# EAGLE schematic micro_2 (EAGLE 9.6.2)
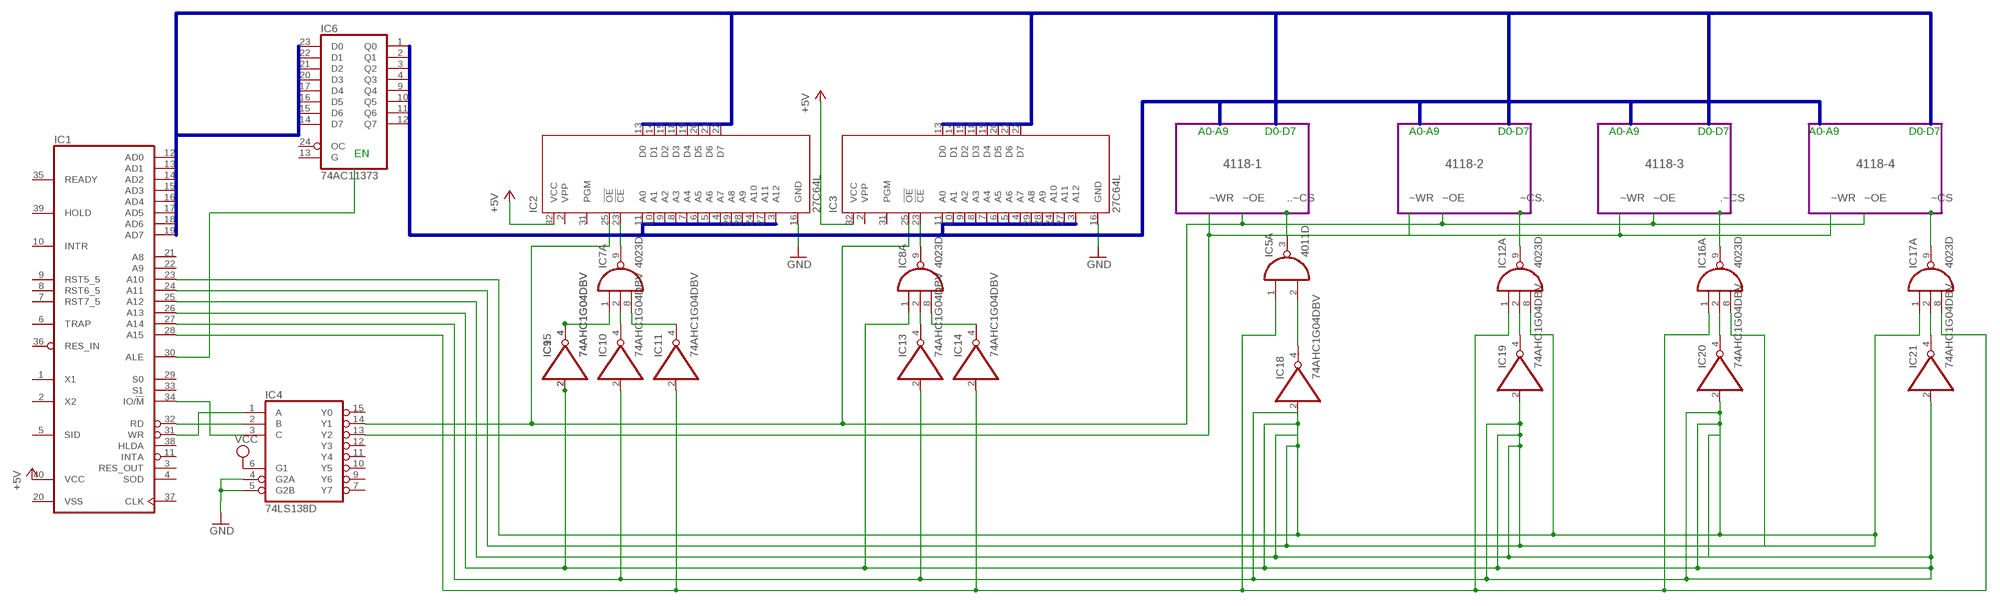
[diagram p0: schematic, sheet 1]

## Parts
IC1  8085  [DIL40]
IC2  27C64L  [PLCC-32]
IC3  27C64L  [PLCC-32]
IC4  74LS138D  [SO16]
IC5  4011D  [SO14]
IC6  74AC11373  [DIL24-6]
IC7  4023D  [SO14]
IC8  4023D  [SO14]
IC9  74AHC1G04DBV  [SOT23-5]
IC10  74AHC1G04DBV  [SOT23-5]
IC11  74AHC1G04DBV  [SOT23-5]
IC12  4023D  [SO14]
IC13  74AHC1G04DBV  [SOT23-5]
IC14  74AHC1G04DBV  [SOT23-5]
IC15  74AHC1G04DBV  [SOT23-5]
IC16  4023D  [SO14]
IC17  4023D  [SO14]
IC18  74AHC1G04DBV  [SOT23-5]
IC19  74AHC1G04DBV  [SOT23-5]
IC20  74AHC1G04DBV  [SOT23-5]
IC21  74AHC1G04DBV  [SOT23-5]

## Module instances
4118-1 = 4118
4118-2 = 4118
4118-3 = 4118
4118-4 = 4118

## Nets
+5V: IC1.40(VCC) IC2.32(VCC) IC3.32(VCC)
..~CS: IC5.3(A:O)
.~CS: IC16.9(A:O)
GND: IC2.16(GND) IC3.16(GND) IC4.4(G2A) IC4.5(G2B)
N$1: IC1.30(ALE)
N$2: IC1.34(IO/!M) IC4.3(C)
N$3: IC1.32(RD) IC4.2(B)
N$4: IC1.31(WR) IC4.1(A)
N$5: IC2.23(!CE) IC7.9(A:O)
N$8: IC3.23(!CE) IC8.9(A:O)
N$9: IC5.2(A:I1) IC18.4(O)
N$10: IC7.1(A:I0) IC9.4(O) IC15.4(O)
N$11: IC7.2(A:I1) IC10.4(O)
N$12: IC7.8(A:I2) IC11.4(O)
N$13: IC12.2(A:I1) IC19.4(O)
N$14: IC8.2(A:I1) IC13.4(O)
N$15: IC8.8(A:I2) IC14.4(O)
N$18: IC1.23(A10) IC1.24(A11) IC1.25(A12) IC1.26(A13) IC1.27(A14) IC8.1(A:I0) IC9.2(I) IC10.2(I) IC12.8(A:I2) IC13.2(I) IC15.2(I) IC16.8(A:I2) IC17.1(A:I0) IC18.2(I) IC19.2(I) IC20.2(I) IC21.2(I)
N$21: IC1.28(A15) IC5.1(A:I0) IC11.2(I) IC12.1(A:I0) IC14.2(I) IC16.1(A:I0) IC17.8(A:I2)
N$24: IC16.2(A:I1) IC20.4(O)
N$25: IC17.2(A:I1) IC21.4(O)
VCC: IC4.6(G1)
~CS: IC17.9(A:O)
~CS.: IC12.9(A:O)
~OE: IC2.25(!OE) IC3.25(!OE) IC4.14(Y1)
~WR: IC4.13(Y2)
Unconnected: IC1.1(X1) IC1.2(X2) IC1.3(RES_OUT) IC1.4(SOD) IC1.5(SID) IC1.6(TRAP) IC1.7(RST7_5) IC1.8(RST6_5) IC1.9(RST5_5) IC1.10(INTR) IC1.11(INTA) IC1.12(AD0) IC1.13(AD1) IC1.14(AD2) IC1.15(AD3) IC1.16(AD4) IC1.17(AD5) IC1.18(AD6) IC1.19(AD7) IC1.21(A8) IC1.22(A9) IC1.29(S0) IC1.33(S1) IC1.35(READY) IC1.36(RES_IN) IC1.37(CLK) IC1.38(HLDA) IC1.39(HOLD) IC2.1(NC) IC2.2(VPP) IC2.3(A12) IC2.4(A7) IC2.5(A6) IC2.6(A5) IC2.7(A4) IC2.8(A3) IC2.9(A2) IC2.10(A1) IC2.11(A0) IC2.13(D0) IC2.14(D1) IC2.15(D2) IC2.18(D3) IC2.19(D4) IC2.20(D5) IC2.21(D6) IC2.22(D7) IC2.24(A10) IC2.27(A11) IC2.28(A9) IC2.29(A8) IC2.31(PGM) IC3.1(NC) IC3.2(VPP) IC3.3(A12) IC3.4(A7) IC3.5(A6) IC3.6(A5) IC3.7(A4) IC3.8(A3) IC3.9(A2) IC3.10(A1) IC3.11(A0) IC3.13(D0) IC3.14(D1) IC3.15(D2) IC3.18(D3) IC3.19(D4) IC3.20(D5) IC3.21(D6) IC3.22(D7) IC3.24(A10) IC3.27(A11) IC3.28(A9) IC3.29(A8) IC3.31(PGM) IC4.7(Y7) IC4.9(Y6) IC4.10(Y5) IC4.11(Y4) IC4.12(Y3) IC4.15(Y0) IC5.4(B:O) IC5.5(B:I0) IC5.6(B:I1) IC5.8(C:I0) IC5.9(C:I1) IC5.10(C:O) IC5.11(D:O) IC5.12(D:I0) IC5.13(D:I1) IC6.1(Q0) IC6.2(Q1) IC6.3(Q2) IC6.4(Q3) IC6.9(Q4) IC6.10(Q5) IC6.11(Q6) IC6.12(Q7) IC6.13(G) IC6.14(D7) IC6.15(D6) IC6.16(D5) IC6.17(D4) IC6.20(D3) IC6.21(D2) IC6.22(D1) IC6.23(D0) IC6.24(OC) IC7.3(B:I0) IC7.4(B:I1) IC7.5(B:I2) IC7.6(B:O) IC7.10(C:O) IC7.11(C:I0) IC7.12(C:I1) IC7.13(C:I2) IC8.3(B:I0) IC8.4(B:I1) IC8.5(B:I2) IC8.6(B:O) IC8.10(C:O) IC8.11(C:I0) IC8.12(C:I1) IC8.13(C:I2) IC12.3(B:I0) IC12.4(B:I1) IC12.5(B:I2) IC12.6(B:O) IC12.10(C:O) IC12.11(C:I0) IC12.12(C:I1) IC12.13(C:I2) IC16.3(B:I0) IC16.4(B:I1) IC16.5(B:I2) IC16.6(B:O) IC16.10(C:O) IC16.11(C:I0) IC16.12(C:I1) IC16.13(C:I2) IC17.3(B:I0) IC17.4(B:I1) IC17.5(B:I2) IC17.6(B:O) IC17.10(C:O) IC17.11(C:I0) IC17.12(C:I1) IC17.13(C:I2)

## Buses
B$1
B$2

## Notes on the sheet
- A0-A9 | D0-D7 | A0-A9 | D0-D7 | A0-A9 | D0-D7 | A0-A9 | D0-D7
- EN

## Power pins joined to a net without a drawn wire
GND: IC4.8(GND) IC6.5(GND) IC6.6(GND) IC6.7(GND) IC6.8(GND) IC9.3(GND) IC10.3(GND) IC11.3(GND) IC13.3(GND) IC14.3(GND) IC15.3(GND) IC18.3(GND) IC19.3(GND) IC20.3(GND) IC21.3(GND)
VCC: IC4.16(VCC) IC6.18(VCC) IC6.19(VCC) IC9.5(VCC) IC10.5(VCC) IC11.5(VCC) IC13.5(VCC) IC14.5(VCC) IC15.5(VCC) IC18.5(VCC) IC19.5(VCC) IC20.5(VCC) IC21.5(VCC)
VDD: IC5.14(P:VDD) IC7.14(P:VDD) IC8.14(P:VDD) IC12.14(P:VDD) IC16.14(P:VDD) IC17.14(P:VDD)
VSS: IC1.20(VSS) IC5.7(P:VSS) IC7.7(P:VSS) IC8.7(P:VSS) IC12.7(P:VSS) IC16.7(P:VSS) IC17.7(P:VSS)

## Library data of the parts
IC1 = micro-intel:8085: MICROCOMPUTER/PERIPHERAL DEVICE; OC_FARNELL: unknown; OC_NEWARK: unknown
IC2 IC3 = microchip:27*64: CMOS EPROM 64 K (8 K x 8), low voltage; OC_FARNELL: unknown; OC_NEWARK: unknown
IC4 = 74xx-eu:74*138: 3-line to 8-line DECODER/DEMULTIPLEXER
IC5 = 40xx:4011: Quad 2-input NAND
IC6 = 74ac-logic:74AC11373: Octal transparent D-type LATCH, 3-state
IC7 IC8 IC12 IC16 IC17 = 40xx:4023: Triple 3-input NAND
IC9-IC11 IC13-IC15 IC18-IC21 = 74xx-little-de:74*1G04: INVERTER Gate

## Module 4118
Ports: 

### Library data of the parts